# EasyEDA Pro project jlcProject.epro, board PCB8
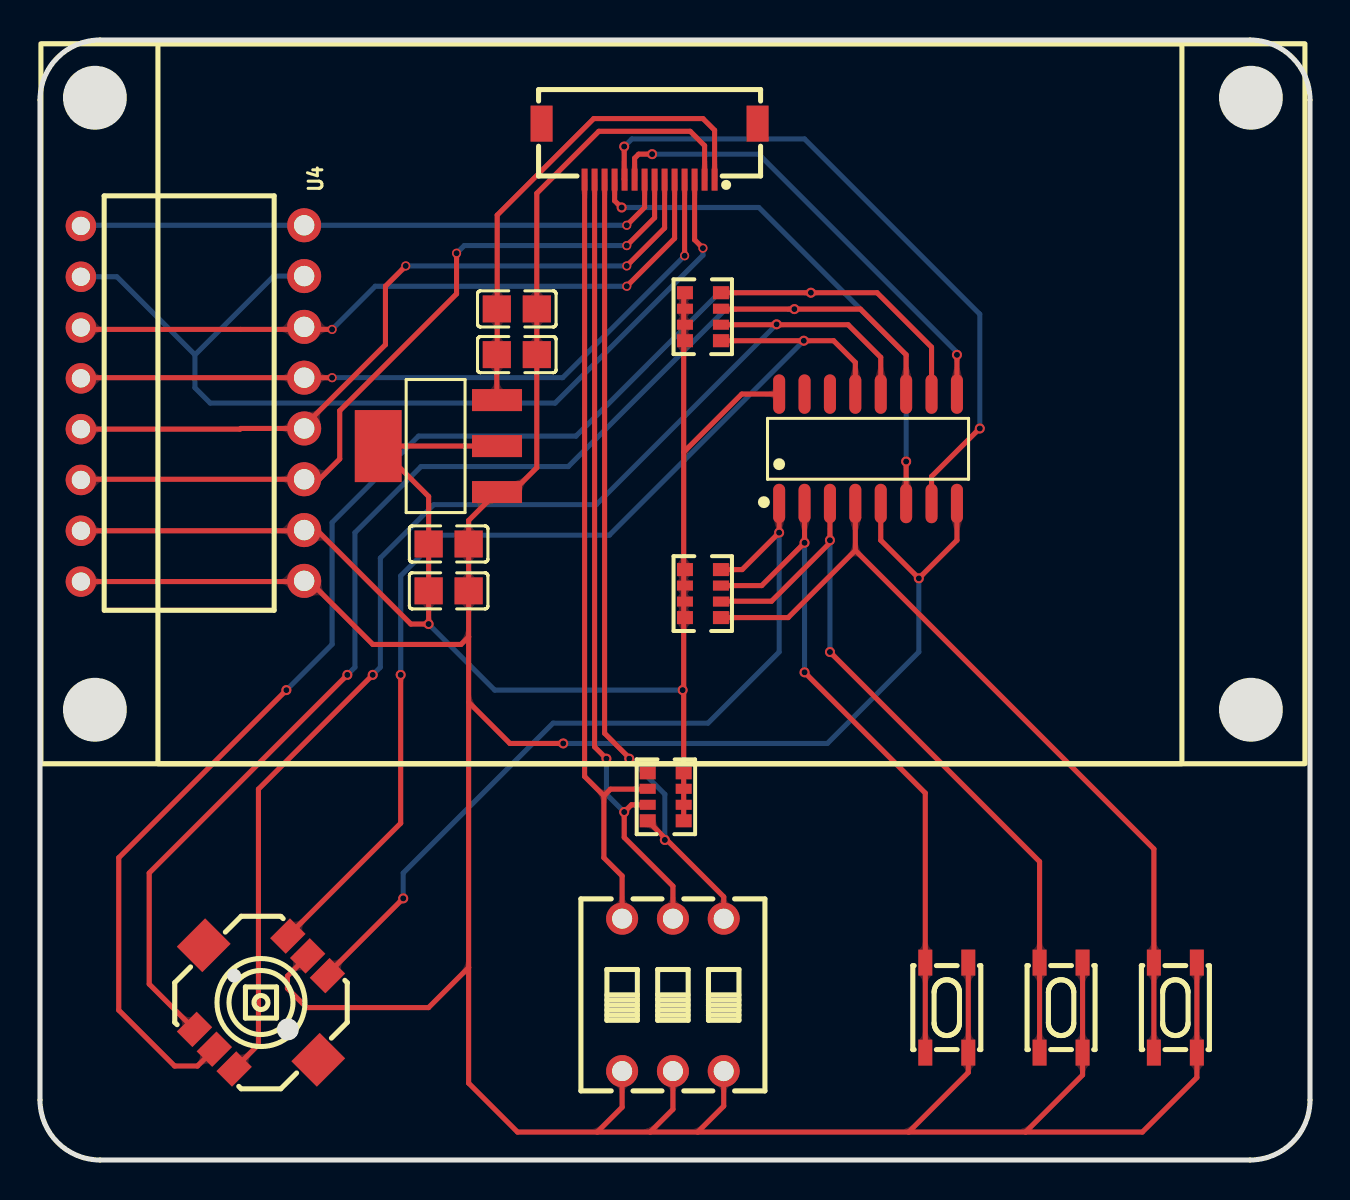
[diagram p11: board, top side]
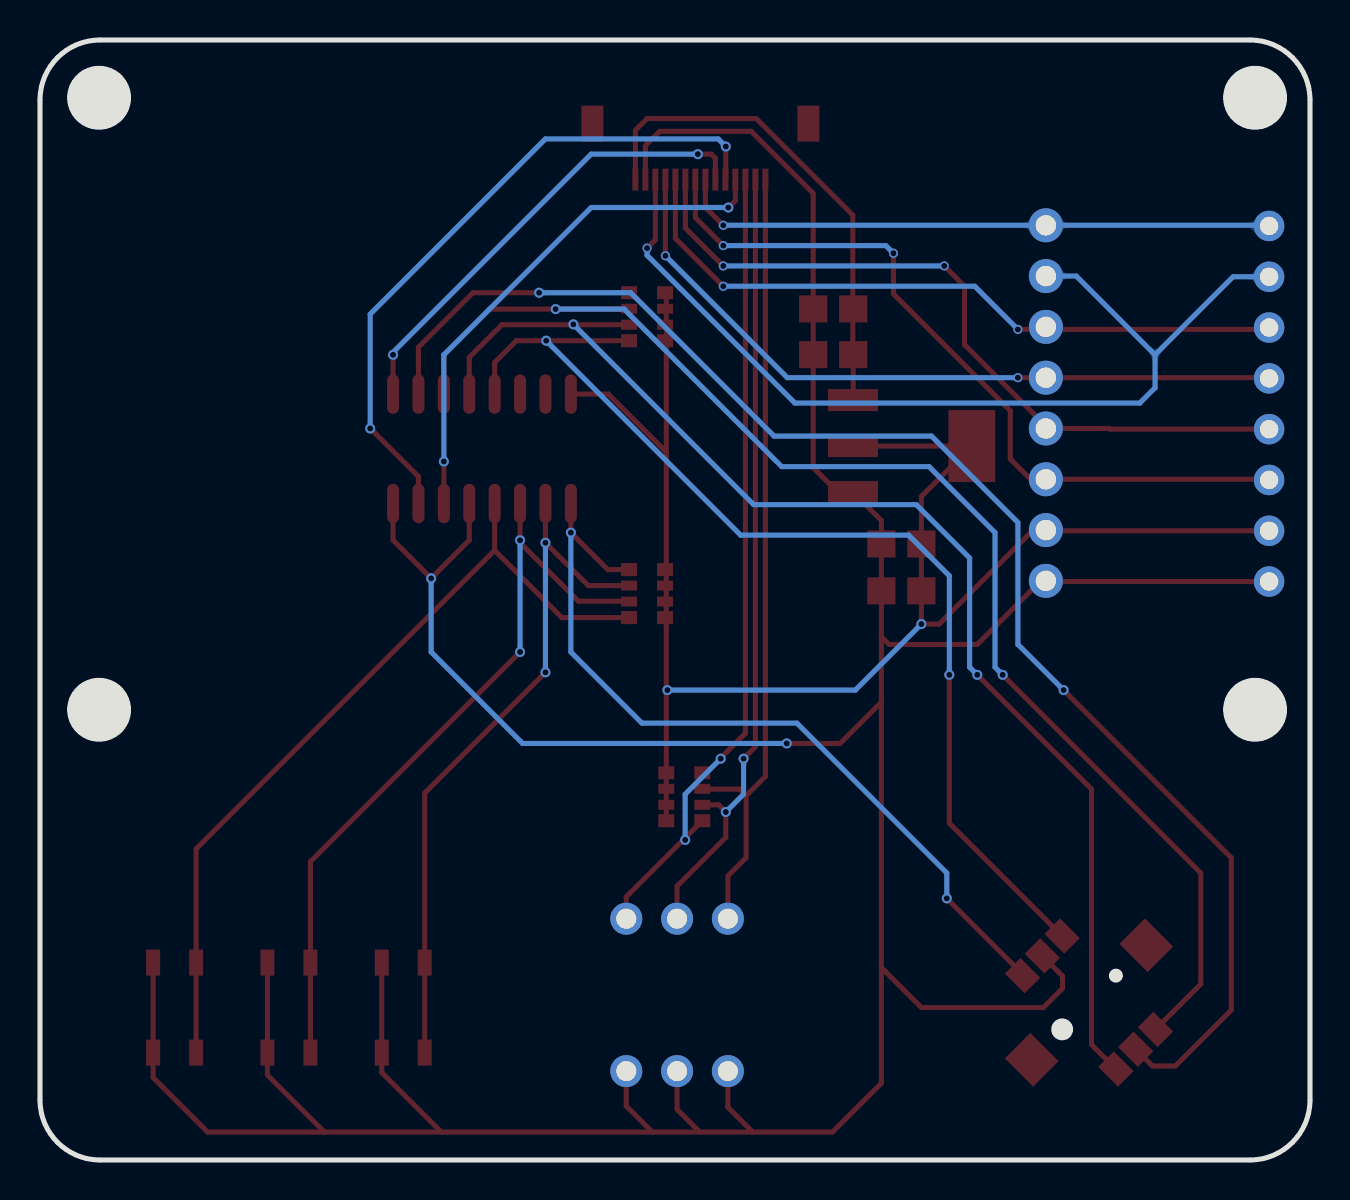
[diagram p12: board, bottom side, seen from below]

Outline 63.5 x 56 mm; copper layers: Top Layer, Bottom Layer. Coordinates in mm from the lower left corner of the outline.
Outline path: 0,53 0,3 arc(0.88,0.88) 3,0 60.5,0 arc(62.62,0.88) 63.5,3 63.5,53 arc(62.62,55.12) 60.5,56 3,56 arc(0.88,55.12) 0,53
Stack: Top Layer 0.035mm / Dielectric1 1.51mm FR4 er 4.5 / Bottom Layer 0.035mm

## Design rules (mm)
template: 自定义配置
spacing copperThickness1oz (default): track to track 0.102, other pairs 0.152 to 0.3
spacing copperThickness2oz: track to track 0.203, other pairs 0.152 to 0.3
track width copperThickness1oz (default): min 0.127, default 0.254, max 2.54
track width copperThickness2oz: min 0.203, default 0.254, max 2.54
differential pair differentialPair (default): width min 0.127, default 0.254, max 2.54; gap min 0.152, default 0.152
via viaSize (default): diameter min 0.5, default 0.61, max 10; hole min 0.3, default 0.305, max 6.299
via viaSize1: diameter min 0.406, default 0.457, max 10; hole min 0.3, default 0.305, max 6.3
net LCD_CS uses viaSize1
net LCD_RST uses viaSize1
net LCD_RS uses viaSize1
net LCD_MOSI uses viaSize1
net LCD_SCK uses viaSize1
net LCD_LED uses viaSize1

## Placement (name value [footprint] x y rotation side)
C1  104  [C0805]  23.84 40.27 0 top
C2  106  [C0805]  23.84 42.55 0 top
C3  104  [C0805]  20.43 28.46 180 top
C4  106  [C0805]  20.43 30.8 180 top
FPC1  FPC-05F-14PH15  [FPC-SMD_14P-P0.50_XUNPU_FPC-05F-14PH15]  30.48 50.42 180 top
RN1  10kΩ  [RES-ARRAY-SMD_0603-8P-L3.2-W1.6-BL]  33.15 28.32 90 top
RN2  10kΩ  [RES-ARRAY-SMD_0603-8P-L3.2-W1.6-BL]  33.15 42.16 90 top
RN3  10kΩ  [RES-ARRAY-SMD_0603-8P-L3.2-W1.6-BL]  31.29 18.16 270 top
SW1  K1-5203UA-02  [SW-TH_K1-5203UA-02]  11.05 7.87 45 top
SW2  TS-1089S-02526  [SW-SMD_4P-L4.2-W3.3-P2.15-LS5.1]  45.34 7.62 90 top
SW3  TS-1089S-02526  [SW-SMD_4P-L4.2-W3.3-P2.15-LS5.1]  51.05 7.62 90 top
SW4  TS-1089S-02526  [SW-SMD_4P-L4.2-W3.3-P2.15-LS5.1]  56.77 7.62 90 top
SW5  DSWB03LHGET  [SW-TH_DSWB03LHGET]  31.65 8.25 0 top
U1  -  [2.0IPS屏]  63.25 19.81 90 top
U2  AMS1117-3.3  [SOT-223-3_L6.5-W3.4-P2.30-LS7.0-BR]  19.88 35.7 0 top
U3  SN74HC148DR  [SOIC-16_L9.9-W3.9-P1.27-LS6.0-BL]  41.4 35.56 0 top
U4  HC-PM254-8.5H-1x8PW  [HDR-TH_HC-PM254-8.5H-1X8PW]  13.21 37.85 270 top

## Footprints (pads in the part's own frame, mm; a bottom-side part is the same pattern mirrored in y, then rotated)
2.0IPS屏
  round 1.524 hole 0.914: 1(9.11,61.2) 2(11.65,61.2) 3(14.19,61.2) 4(16.73,61.2) 5(19.27,61.2) 6(21.81,61.2) 7(24.35,61.2) 8(26.89,61.2)
C0805
  rect 1.41x1.35 smd: 1(-1,0) 2(1,0)
FPC-SMD_14P-P0.50_XUNPU_FPC-05F-14PH15
  rect 0.3x1.1 smd: 1(-3.25,1.4) 2(-2.75,1.4) 3(-2.25,1.4) 4(-1.75,1.4) 5(-1.25,1.4) 6(-0.75,1.4) 7(-0.25,1.4) 8(0.25,1.4) 9(0.75,1.4) 10(1.25,1.4) 11(1.75,1.4) 12(2.25,1.4) 13(2.75,1.4) 14(3.25,1.4)
  rect 1.1x1.8 smd: 15(5.4,-1.4) 16(-5.4,-1.4)
HDR-TH_HC-PM254-8.5H-1X8PW
  round 1.7 hole 1.02: 1(-8.89,0) 2(-6.35,0) 3(-3.81,0) 4(-1.27,0) 5(1.27,0) 6(3.81,0) 7(6.35,0) 8(8.89,0)
RES-ARRAY-SMD_0603-8P-L3.2-W1.6-BL
  rect 0.65x0.8 smd: 1(-1.2,-0.9) 4(1.2,-0.9) 5(1.2,0.9) 8(-1.2,0.9)
  rect 0.5x0.8 smd: 2(-0.4,-0.9) 3(0.4,-0.9) 6(0.4,0.9) 7(-0.4,0.9)
SOIC-16_L9.9-W3.9-P1.27-LS6.0-BL
  oval 0.602x1.971 smd: 1(-4.445,-2.736) 2(-3.175,-2.736) 3(-1.905,-2.736) 4(-0.635,-2.736) 5(0.635,-2.736) 6(1.905,-2.736) 7(3.175,-2.736) 8(4.445,-2.736) 9(4.445,2.736) 10(3.175,2.736) 11(1.905,2.736) 12(0.635,2.736) 13(-0.635,2.736) 14(-1.905,2.736) 15(-3.175,2.736) 16(-4.445,2.736)
SOT-223-3_L6.5-W3.4-P2.30-LS7.0-BR
  rect 2.5x1.1 smd: 1(2.97,-2.3) 2(2.97,0) 3(2.97,2.3)
  rect 2.34x3.6 smd: 4(-2.97,0)
SW-SMD_4P-L4.2-W3.3-P2.15-LS5.1
  rect 1.3x0.7 smd: 1(-2.25,1.075) 2(2.25,1.075) 3(-2.25,-1.075) 4(2.25,-1.075)
SW-TH_DSWB03LHGET
  round 1.6 hole 1: 1(-2.54,3.81) 2(0,3.81) 3(2.54,3.81) 4(-2.54,-3.81) 5(0,-3.81) 6(2.54,-3.81)
SW-TH_K1-5203UA-02
  rect 1.4x1.1 smd: 1(-3.3,1.4) 2(-3.3,0) 3(-3.3,-1.4) 4(3.3,1.4) 5(3.3,0) 6(3.3,-1.4)
  rect 2x1.8 smd: 7(0,4.05) 8(0,-4.05)

## Nets
As in the schematic.

Pads without a net: FPC1 15 16; RN3 1; SW1 7 8; U3 14 15

## Via types
v1: diameter 0.5, hole 0.299, Top Layer to Bottom Layer, 6 vias
v2: diameter 0.5, hole 0.305, Top Layer to Bottom Layer, 22 vias
v3: diameter 0.457, hole 0.305, Top Layer to Bottom Layer, 10 vias

## Routing (per net, layer and track width the routed paths; a pad name or vN(x,y) marks a point on that pad's centre or on a via; arc(x,y) is an arc through that point)
3.3V: length 81.8
  Top Layer w0.254: 19.43,28.46 v2(19.43,26.8) 18.54,26.8 13.88,31.46 U1.2 ; U2.2 U2.4 19.43,33.18 C4.2 C3.2 ; 32.19,23.55 32.19,29.46 ; 32.19,29.46 RN1.5 ; 32.19,29.46 32.19,35.39 ; v2(32.13,23.5) 32.19,23.5 RN3.8 RN3.7 RN3.6 RN3.5 ; 32.19,35.39 32.19,43.3 RN2.5 ; 32.19,35.39 35.09,38.3 U3.16
  Bottom Layer w0.254: v2(19.43,26.8) 22.73,23.5 v2(32.13,23.5)
5V: length 24.8
  Top Layer w0.254: 33.73,49.02 33.73,51.49 33.15,52.07 27.69,52.07 22.86,47.24 22.86,40.29 C1.1 22.84,38.01 U2.3
GND: length 203.5
  Top Layer w0.254: 32.89,1.4 34.19,2.7 SW5.6 ; 32.89,1.4 43.43,1.4 ; 32.89,1.4 30.51,1.4 ; 30.51,1.4 31.65,2.53 SW5.5 ; 30.51,1.4 27.86,1.4 ; U3.8 45.85,30.99 v1(43.94,29.08) 42.04,30.99 U3.5 ; 21.43,22.89 21.43,26.16 ; 21.43,22.89 23.5,20.83 v2(26.16,20.83) ; 21.43,22.89 21.43,9.63 ; 21.43,26.16 21.05,25.78 16.64,25.78 13.5,28.92 U1.1 ; 21.43,26.16 C3.1 C4.1 21.43,31.98 U2.1 23.62,33.4 24.84,34.62 C1.2 C2.2 24.84,48.34 27.94,51.44 32.51,51.44 33.23,50.72 33.23,49.02 ; 27.86,1.4 23.88,1.4 21.43,3.84 21.43,9.63 ; 27.86,1.4 29.11,2.64 SW5.4 ; 43.43,1.4 46.41,4.38 SW2.3 SW2.4 ; 43.43,1.4 49.28,1.4 ; 57.84,9.87 57.84,4.12 55.12,1.4 49.28,1.4 ; 21.43,9.63 19.43,7.62 13.33,7.62 12.37,8.58 12.37,9.2 SW1.5 ; 49.28,1.4 52.13,4.25 SW3.3 SW3.4
  Bottom Layer w0.254: v1(43.94,29.08) 43.94,25.4 39.37,20.83 v2(26.16,20.83)
0: length 77.8
  Top Layer w0.254: SW1.2 7.87,4.7 6.73,4.7 3.94,7.49 3.94,15.11 v1(12.32,23.5) ; RN2.4 v1(38.54,43.36) 41.85,43.36 44.58,40.64 U3.10
  Bottom Layer w0.254: v1(12.32,23.5) 14.61,25.78 14.61,31.88 18.92,36.19 26.8,36.19 33.97,43.36 v1(38.54,43.36)
1: length 68.8
  Top Layer w0.254: v2(15.37,24.26) 5.46,14.35 5.46,8.8 SW1.1 ; U3.11 43.31,40.26 41.02,42.55 v1(37.72,42.55) 34.07,42.55 RN2.3
  Bottom Layer w0.254: v2(15.37,24.26) 15.75,24.64 15.75,31.37 19.05,34.67 26.42,34.67 34.29,42.55 v1(37.72,42.55)
2: length 63.7
  Top Layer w0.254: v2(16.64,24.26) 10.92,18.54 10.92,5.77 SW1.3 ; RN2.2 40.41,41.76 42.04,40.13 U3.12
  Bottom Layer w0.254: v2(16.64,24.26) 17.02,24.64 17.02,30.1 19.69,32.77 27.81,32.77 v1(36.83,41.78)
3: length 54.1
  Top Layer w0.254: v2(18.03,24.26) 18.03,16.84 12.39,11.2 ; RN2.1 v1(38.19,40.96) 39.68,40.96 40.77,39.88 U3.13
  Bottom Layer w0.254: v1(38.19,40.96) 28.47,31.24 20.07,31.24 18.03,29.21 v2(18.03,24.26)
4: length 41.2
  Top Layer w0.254: RN1.4 35.11,29.52 v2(36.96,31.37) U3.1 ; SW1.6 14.37,9.29 v2(18.16,13.08)
  Bottom Layer w0.254: v2(18.16,13.08) 18.16,14.35 25.65,21.84 33.4,21.84 36.96,25.4 v2(36.96,31.37)
5: length 35
  Top Layer w0.254: v2(38.23,24.38) 44.26,18.35 SW2.2 SW2.1 ; U3.2 v2(38.23,30.86) 36.09,28.72 RN1.3
  Bottom Layer w0.254: v2(38.23,30.86) v2(38.23,24.38)
6: length 38.6
  Top Layer w0.254: v2(39.5,25.4) 49.98,14.92 SW3.2 SW3.1 ; RN1.2 34.07,27.94 36.58,27.94 39.5,30.86 v2(39.5,30.99) U3.3
  Bottom Layer w0.254: v2(39.5,25.4) v2(39.5,30.99)
7: length 41.7
  Top Layer w0.254: 40.77,30.48 U3.4 ; 40.77,30.48 55.69,15.55 SW4.2 SW4.1 ; 40.77,30.48 37.41,27.12 RN1.1
A0: length 23.5
  Top Layer w0.254: 29.73,49.02 29.73,50.09 29.93,50.29 v2(30.61,50.29) ; v2(45.85,40.26) U3.9
  Bottom Layer w0.254: v2(45.85,40.26) 45.85,40.39 35.94,50.29 v2(30.61,50.29)
A1: length 33.7
  Top Layer w0.254: v2(29.21,50.67) 29.21,49.04 29.23,49.02 ; v2(46.99,36.58) 46.98,36.58 44.58,34.17 U3.7
  Bottom Layer w0.254: v2(29.21,50.67) 29.59,51.05 38.23,51.05 46.99,42.29 v2(46.99,36.58)
A2: length 26.3
  Top Layer w0.254: v2(29.08,47.62) 29.07,47.62 28.73,47.96 28.73,49.02 ; v2(43.31,34.92) U3.6
  Bottom Layer w0.254: v2(43.31,34.92) 43.31,40.26 35.94,47.62 v2(29.08,47.62)
K0: length 40.8
  Top Layer w0.254: v2(31.24,16) 31.25,16 31.3,16.05 ; 31.3,16.05 RN3.4 ; 31.3,16.05 34.19,13.16 SW5.3 ; v2(29.46,20.07) 29.46,20.1 28.23,21.34 28.23,49.02
  Bottom Layer w0.254: v2(31.24,16) 31.24,18.29 v2(29.46,20.07)
K1: length 39.9
  Top Layer w0.254: 27.73,49.02 27.73,20.66 v2(28.32,20.07) ; RN3.3 29.57,17.76 v2(29.21,17.4) 29.21,16.13 31.65,13.69 SW5.2
  Bottom Layer w0.254: v2(29.21,17.4) 28.32,18.29 v2(28.32,20.07)
K2: length 40.1
  Top Layer w0.254: 28.19,18.21 27.23,19.18 27.23,49.02 ; 28.19,18.21 28.19,15.11 29.11,14.2 SW5.1 ; 28.19,18.21 28.52,18.54 30.37,18.54 RN3.2
LCD_CS: length 48.8
  Top Layer w0.254: 32.73,49.02 32.73,46.01 v3(33.15,45.59)
  Bottom Layer w0.254: 7.75,40.26 7.75,38.61 8.51,37.85 25.76,37.85 33.15,45.24 v3(33.15,45.59) ; 7.75,40.26 11.68,44.2 U4.2 ; 7.75,40.26 3.84,44.16 U1.7
LCD_LED: length 30
  Top Layer w0.254: v3(29.34,46.74) 30.23,47.63 30.23,49.02
  Bottom Layer w0.254: v3(29.34,46.74) 2.08,46.74 U1.8
LCD_MOSI: length 37.5
  Top Layer w0.254: 31.23,49.02 31.23,46.6 v3(29.34,44.7) ; v3(18.29,44.7) 17.27,43.69 17.27,40.77 13.08,36.58 10.03,36.58 10,36.54 U1.4
  Bottom Layer w0.254: v3(18.29,44.7) v3(29.34,44.7)
LCD_RS: length 34.5
  Top Layer w0.254: 31.73,49.02 31.73,46.08 v3(29.34,43.69) ; U1.6 2.14,41.53 v3(14.61,41.53)
  Bottom Layer w0.254: v3(29.34,43.69) 16.76,43.69 v3(14.61,41.53)
LCD_RST: length 36.6
  Top Layer w0.254: v3(14.61,39.12) U4.4 2.08,39.12 U1.5 ; 32.23,49.02 v3(32.23,45.21)
  Bottom Layer w0.254: v3(14.61,39.12) 26.13,39.12 v3(32.23,45.21) 32.13,45.21
LCD_SCK: length 38.6
  Top Layer w0.254: v3(20.83,45.34) 20.83,43.31 14.99,37.47 14.99,35.05 13.97,34.04 2.08,34.04 U1.3 ; 30.73,49.02 30.73,47.11 v3(29.34,45.72)
  Bottom Layer w0.254: v3(20.83,45.34) 21.21,45.72 v3(29.34,45.72)

Small or netless copper shapes (teardrops, artwork), in the pictures only: 204 on Top Layer, 46 on Bottom Layer
